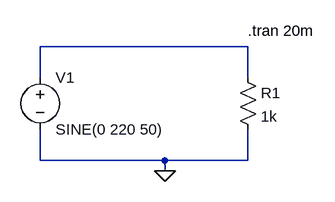
[diagram p0: schematic Draft2.asc]
Draft2.asc, the LTspice schematic file:
Version 4
SHEET 1 880 680
WIRE 368 80 48 80
WIRE 48 128 48 80
WIRE 368 128 368 80
WIRE 48 256 48 208
WIRE 240 256 48 256
WIRE 368 256 368 208
WIRE 368 256 240 256
WIRE 240 272 240 256
FLAG 240 272 0
SYMBOL voltage 48 112 R0
WINDOW 123 0 0 Left 0
WINDOW 39 0 0 Left 0
SYMATTR InstName V1
SYMATTR Value SINE(0 220 50)
SYMBOL res 352 112 R0
SYMATTR InstName R1
SYMATTR Value 1k
TEXT 368 56 Left 2 !.tran 20m

The netlist it stands for:
* Draft2.asc
V1 N001 0 SINE(0 220 50)
R1 N001 0 1k
.tran 20m
.backanno
.end